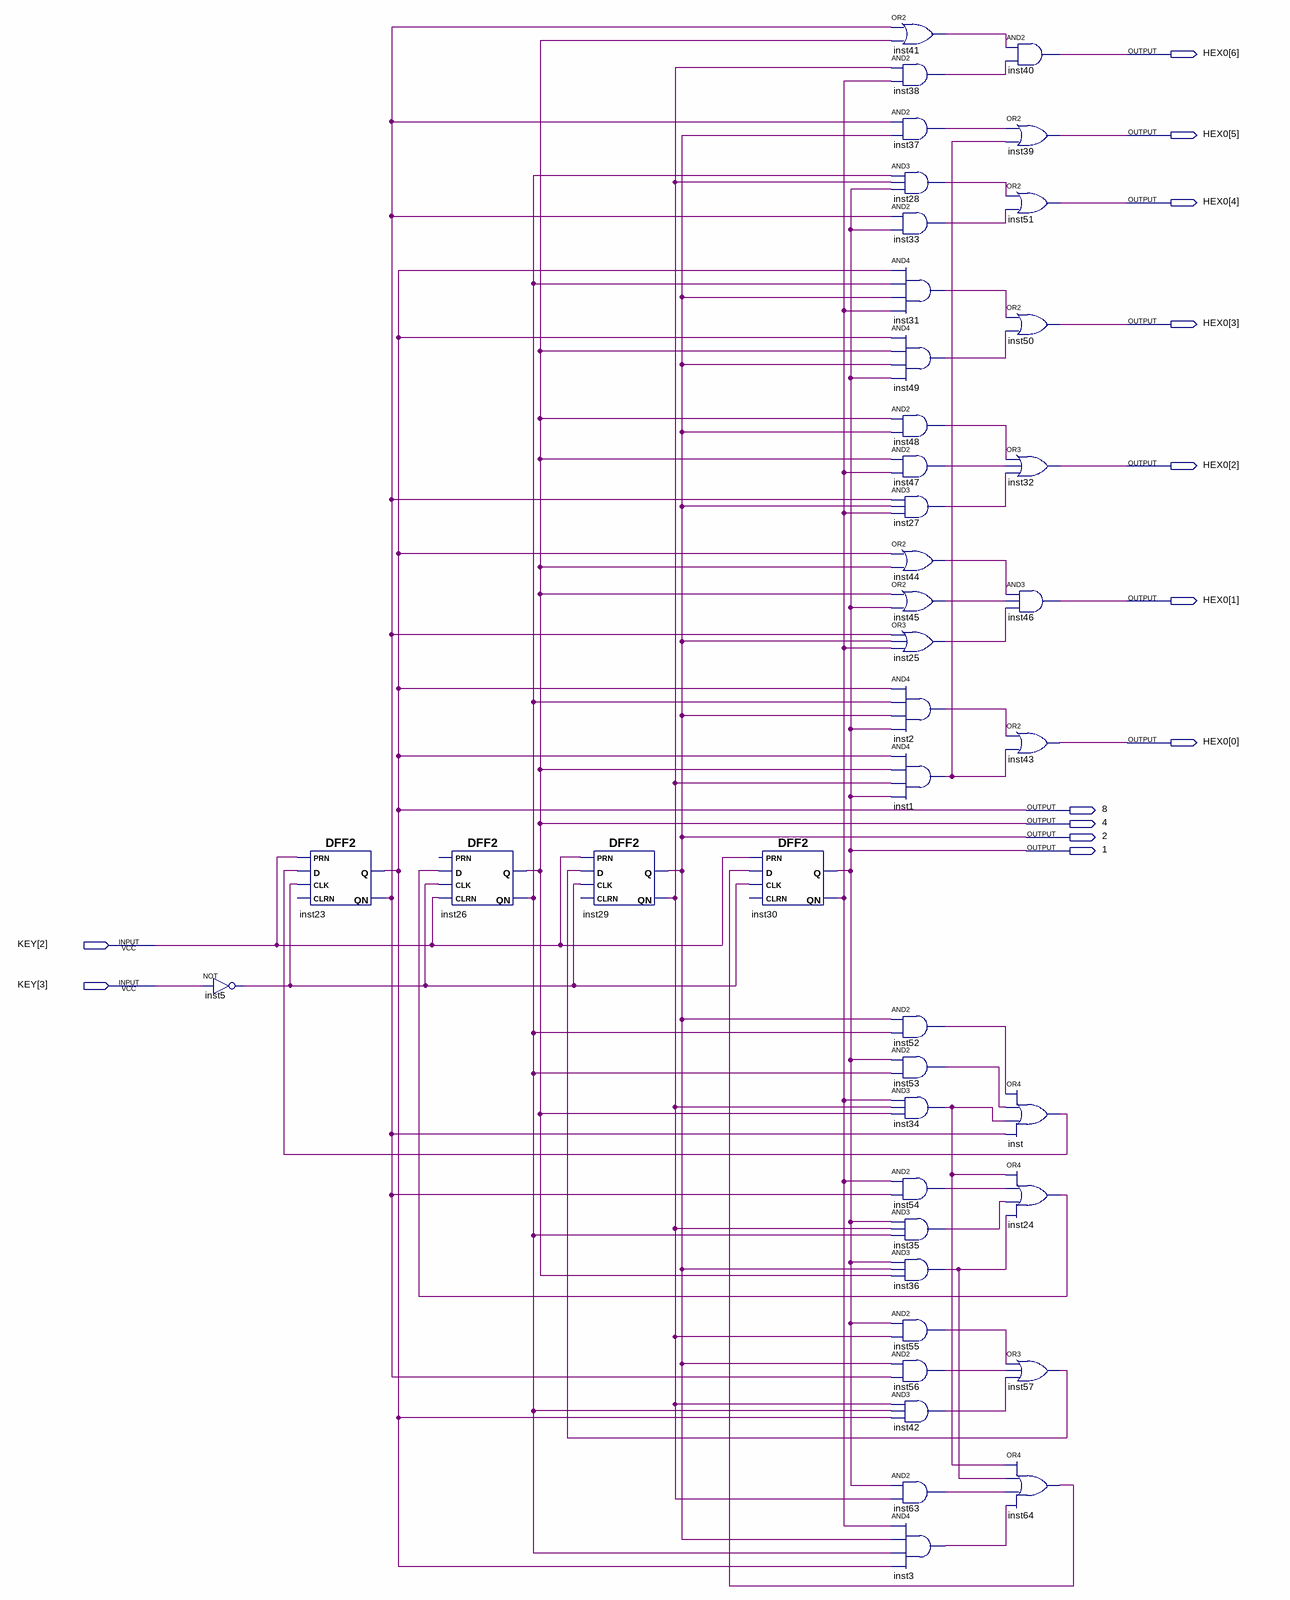
[diagram p0: schematic sheet]
// Quartus schematic d.bdf as structural Verilog: 42 symbols, 13 pins
module d (
  input  [3:2] KEY,
  output [6:0] HEX0,
  output \8 ,
  output \4 ,
  output \2 ,
  output \1 
);

  wire inst1_out, inst2_out, inst3_out, inst5_out, inst23_qn, inst24_out, inst25_out, inst26_qn, inst27_out,
       inst28_out, inst29_qn, inst30_qn, inst31_out, inst33_out, inst34_out, inst35_out, inst36_out,
       inst37_out, inst38_out, inst41_out, inst42_out, inst44_out, inst45_out, inst47_out, inst48_out,
       inst49_out, inst52_out, inst53_out, inst54_out, inst55_out, inst56_out, inst57_out, inst63_out,
       inst64_out, inst_out;

  not inst5 (inst5_out, KEY[3]);
  DFF2 inst23 (.CLK(inst5_out), .D(inst_out), .PRN(KEY[2]), .Q(\8 ), .QN(inst23_qn));  // open: CLRN
  DFF2 inst26 (.CLK(inst5_out), .D(inst24_out), .CLRN(KEY[2]), .Q(\4 ), .QN(inst26_qn));  // open: PRN
  DFF2 inst29 (.CLK(inst5_out), .D(inst57_out), .PRN(KEY[2]), .Q(\2 ), .QN(inst29_qn));  // open: CLRN
  DFF2 inst30 (.CLK(inst5_out), .D(inst64_out), .PRN(KEY[2]), .Q(\1 ), .QN(inst30_qn));  // open: CLRN
  or inst41 (inst41_out, inst23_qn, \4 );
  and inst38 (inst38_out, inst29_qn, inst30_qn);
  and inst37 (inst37_out, inst23_qn, \2 );
  and inst28 (inst28_out, inst26_qn, inst29_qn, \1 );
  and inst33 (inst33_out, inst23_qn, \1 );
  and inst31 (inst31_out, \8 , inst26_qn, \2 , inst30_qn);
  and inst49 (inst49_out, \8 , \4 , \2 , \1 );
  and inst48 (inst48_out, \4 , \2 );
  and inst47 (inst47_out, \4 , inst30_qn);
  and inst27 (inst27_out, inst23_qn, \2 , inst30_qn);
  or inst44 (inst44_out, \8 , \4 );
  or inst45 (inst45_out, \4 , \1 );
  or inst25 (inst25_out, inst23_qn, \2 , inst30_qn);
  and inst2 (inst2_out, \8 , inst26_qn, \2 , \1 );
  and inst1 (inst1_out, \8 , \4 , inst29_qn, \1 );
  and inst52 (inst52_out, \2 , inst26_qn);
  and inst53 (inst53_out, \1 , inst26_qn);
  and inst34 (inst34_out, inst30_qn, inst29_qn, \4 );
  and inst54 (inst54_out, inst30_qn, inst23_qn);
  and inst35 (inst35_out, \1 , inst29_qn, inst26_qn);
  and inst36 (inst36_out, \1 , \2 , \4 );
  and inst55 (inst55_out, \1 , inst29_qn);
  and inst56 (inst56_out, \2 , inst23_qn);
  and inst42 (inst42_out, inst29_qn, inst26_qn, \8 );
  and inst63 (inst63_out, \1 , inst29_qn);
  and inst3 (inst3_out, inst30_qn, \2 , inst26_qn, \8 );
  and inst40 (HEX0[6], inst41_out, inst38_out);
  or inst39 (HEX0[5], inst37_out, inst1_out);
  or inst51 (HEX0[4], inst28_out, inst33_out);
  or inst50 (HEX0[3], inst31_out, inst49_out);
  or inst32 (HEX0[2], inst48_out, inst47_out, inst27_out);
  and inst46 (HEX0[1], inst44_out, inst45_out, inst25_out);
  or inst43 (HEX0[0], inst2_out, inst1_out);
  or inst (inst_out, inst52_out, inst53_out, inst34_out, inst23_qn);
  or inst24 (inst24_out, inst34_out, inst54_out, inst35_out, inst36_out);
  or inst57 (inst57_out, inst55_out, inst56_out, inst42_out);
  or inst64 (inst64_out, inst34_out, inst36_out, inst63_out, inst3_out);
endmodule
